# EAGLE design ArduinoPB-Pro-Mini (EAGLE 7.3.0)
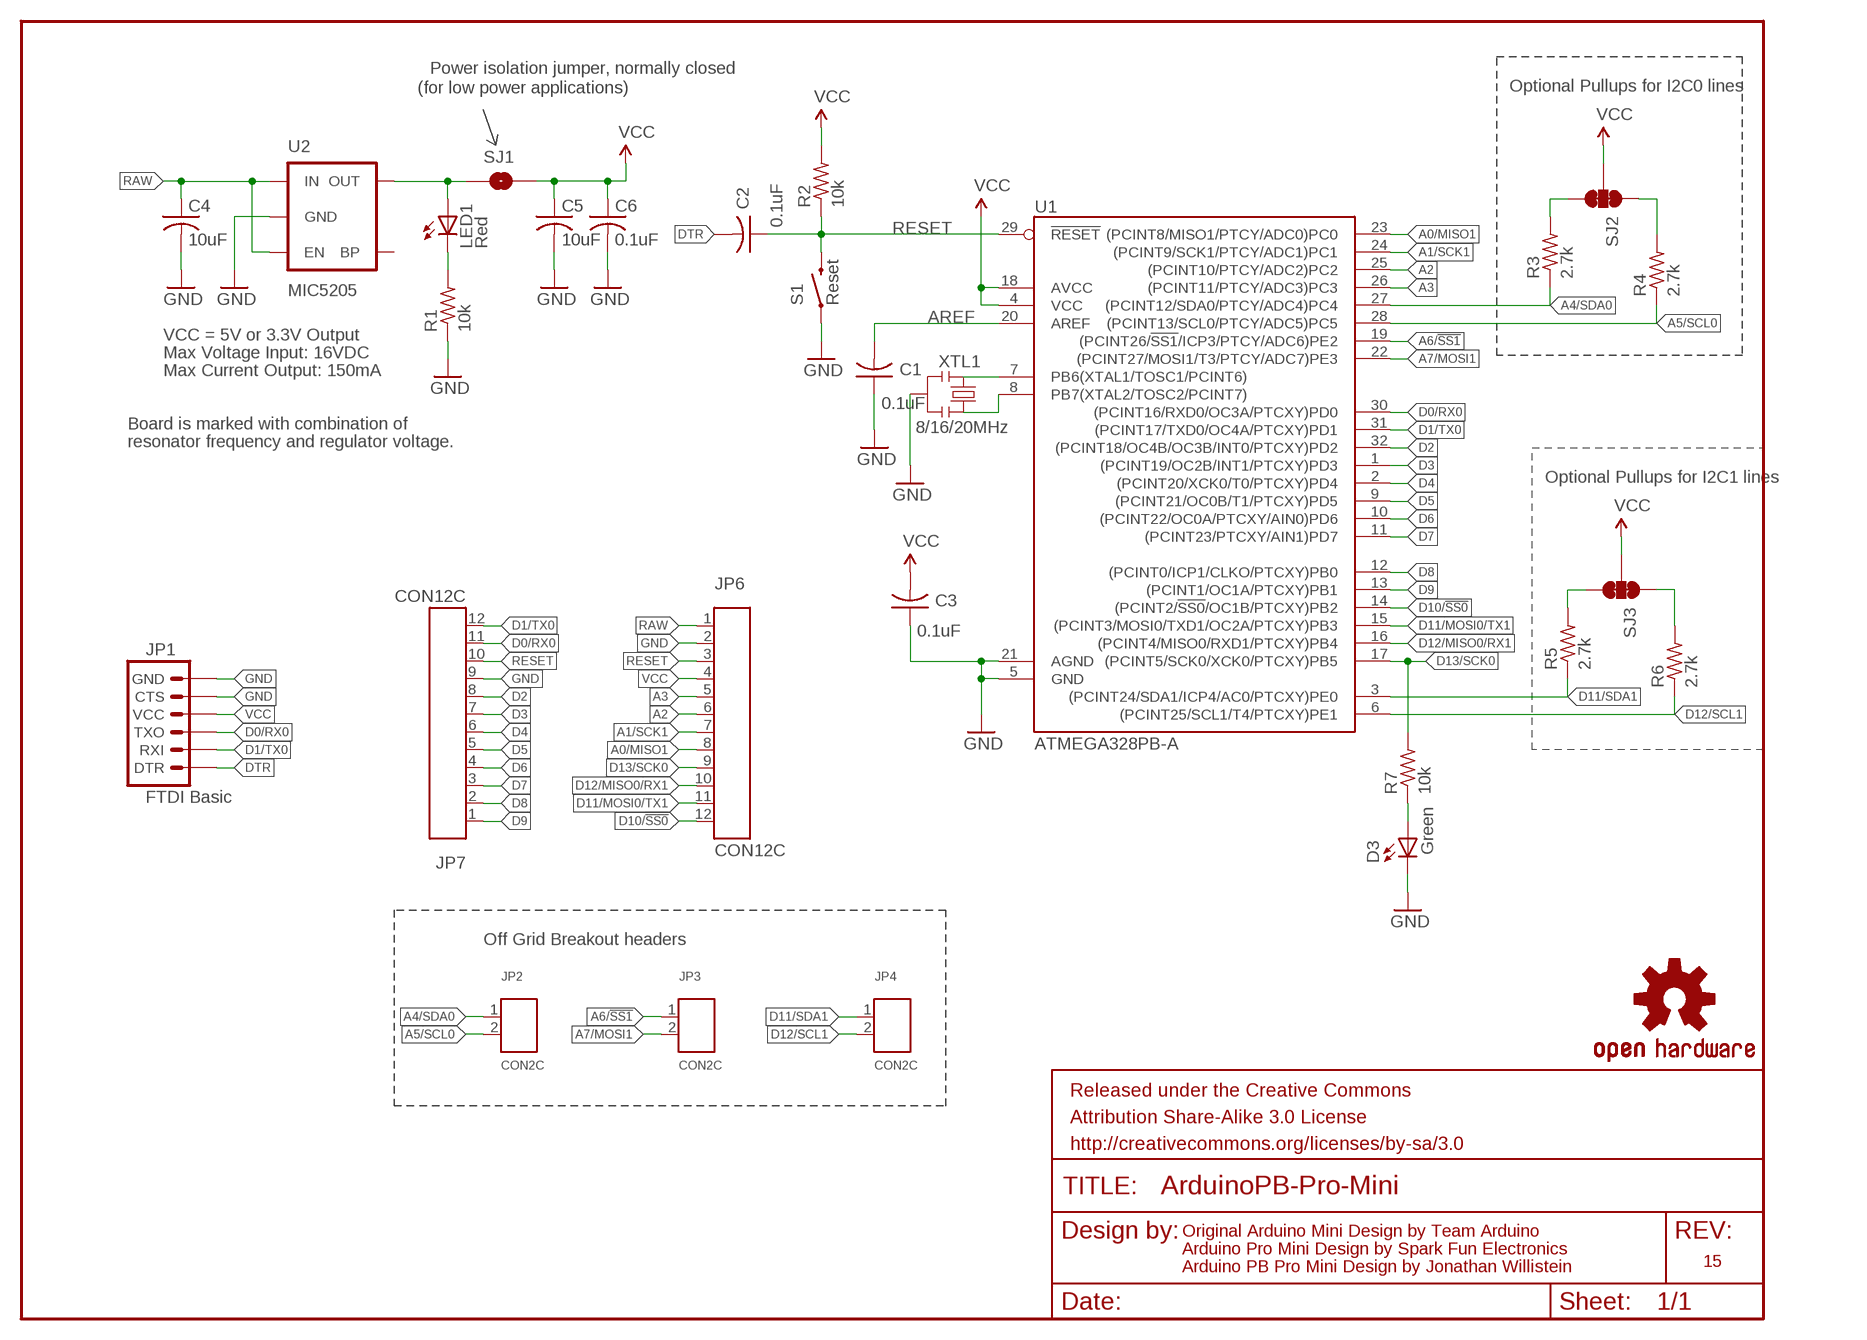
[diagram p0: schematic, sheet 1]

## Parts
C1  0.1uF  C-USC0603  [C0603]
C2  0.1uF  C-USC0603  [C0603]
C3  0.1uF  C-USC0603  [C0603]
C4  10uF  C-USC0805  [C0805]
C5  10uF  C-USC0805  [C0805]
C6  0.1uF  C-USC0603  [C0603]
D3  Green  LED  [0603-LED-ALT1]
FRAME1  FRAME-LETTER  [CREATIVE_COMMONS]
JP1  FTDI Basic  ARDUINO_SERIAL_PROGRAM  [1X6C]
JP2  CON2C  [1X2C]
JP3  CON2C  [1X2C]
JP4  CON2C  [1X2C]
JP6  CON12C  [1X12C]
JP7  CON12C  [1X12C]
LED1  Red  LED  [0603-LED-ALT1]
R1  10k  R-US_R0603  [R0603]
R2  10k  R-US_R0603  [R0603]
R3  2.7k  R-US_R0603  [R0603]
R4  2.7k  R-US_R0603  [R0603]
R5  2.7k  R-US_R0603  [R0603]
R6  2.7k  R-US_R0603  [R0603]
R7  10k  R-US_R0603  [R0603]
S1  Reset  SWITCH-MOMENTARY-2SMD-ALT01  [TACTILE-SWITCH-SMD-ALT01]
SJ1  SOLDERJUMPERTRACE  [SJ_2S-TRACE]
SJ2  JUMPER-PAD-3-NC_BY_TRACE  [PAD-JUMPER-3-3OF3_NC_BY_TRACE_YES_SILK_FULL_BOX]
SJ3  JUMPER-PAD-3-NC_BY_TRACE  [PAD-JUMPER-3-3OF3_NC_BY_TRACE_YES_SILK_FULL_BOX]
U1  ATMEGA328PB-A  [TQFP32-08]
U2  MIC5205  V_REG_LDOSMD  [SOT23-5]
U$3  OSHW-LOGOS  [OSHW-LOGO-S]
XTL1  8/16/20MHz  RESONATOR1:1  [RESONATOR-SMD-1:1]

## Nets
A0/MISO1: JP6.8 U1.23((PCINT8/MISO1/PTCY/ADC0)PC0)
A1/SCK1: JP6.7 U1.24((PCINT9/SCK1/PTCY/ADC1)PC1)
A2: JP6.6 U1.25((PCINT10/PTCY/ADC2)PC2)
A3: JP6.5 U1.26((PCINT11/PTCY/ADC3)PC3)
A4/SDA0: JP2.1 R3.1 U1.27((PCINT12/SDA0/PTCY/ADC4)PC4)
A5/SCL0: JP2.2 R4.1 U1.28((PCINT13/SCL0/PTCY/ADC5)PC5)
A6/!SS1: JP3.1 U1.19((PCINT26/!SS1!/ICP3/PTCY/ADC6)PE2)
A7/MOSI1: JP3.2 U1.22((PCINT27/MOSI1/T3/PTCY/ADC7)PE3)
AREF: C1.2 U1.20(AREF)
D0/RX0: JP1.3(TXO) JP7.11 U1.30((PCINT16/RXD0/OC3A/PTCXY)PD0)
D1/TX0: JP1.2(RXI) JP7.12 U1.31((PCINT17/TXD0/OC4A/PTCXY)PD1)
D2: JP7.8 U1.32((PCINT18/OC4B/OC3B/INT0/PTCXY)PD2)
D3: JP7.7 U1.1((PCINT19/OC2B/INT1/PTCXY)PD3)
D4: JP7.6 U1.2((PCINT20/XCK0/T0/PTCXY)PD4)
D5: JP7.5 U1.9((PCINT21/OC0B/T1/PTCXY)PD5)
D6: JP7.4 U1.10((PCINT22/OC0A/PTCXY/AIN0)PD6)
D7: JP7.3 U1.11((PCINT23/PTCXY/AIN1)PD7)
D8: JP7.2 U1.12((PCINT0/ICP1/CLKO/PTCXY)PB0)
D9: JP7.1 U1.13((PCINT1/OC1A/PTCXY)PB1)
D10/!SS0: JP6.12 U1.14((PCINT2/!SS0!/OC1B/PTCXY)PB2)
D11/MOSI0/TX1: JP6.11 U1.15((PCINT3/MOSI0/TXD1/OC2A/PTCXY)PB3)
D11/SDA1: JP4.1 R5.1 U1.3((PCINT24/SDA1/ICP4/AC0/PTCXY)PE0)
D12/MISO0/RX1: JP6.10 U1.16((PCINT4/MISO0/RXD1/PTCXY)PB4)
D12/SCL1: JP4.2 R6.1 U1.6((PCINT25/SCL1/T4/PTCXY)PE1)
D13/SCK0: JP6.9 R7.2 U1.17((PCINT5/SCK0/XCK0/PTCXY)PB5)
DTR: C2.2 JP1.1(DTR)
GND [vcc]: C1.1 C3.1 C4.2 C5.2 C6.2 D3.C JP1.5(CTS) JP1.6(GND) JP6.2 JP7.9 R1.1 S1.1 S1.2 U1.5(GND) U1.21(AGND) U2.2(GND) XTL1.2
N$1: U1.7(PB6(XTAL1/TOSC1/PCINT6)) XTL1.1
N$2: U1.8(PB7(XTAL2/TOSC2/PCINT7)) XTL1.3
N$4: LED1.C R1.2
N$5: R3.2 SJ2.3
N$6: R4.2 SJ2.1
N$7: D3.A R7.1
N$10: R5.2 SJ3.3
N$11: R6.2 SJ3.1
RAW [vcc]: C4.1 JP6.1 U2.1(IN) U2.3(EN)
RESET: C2.1 JP6.3 JP7.10 R2.1 S1.3 S1.4 U1.29(!RESET!)
VCC: C3.2 C5.1 C6.1 JP1.4(VCC) JP6.4 R2.2 SJ1.2 SJ2.2 SJ3.2 U1.4(VCC) U1.18(AVCC)
VOUT: LED1.A SJ1.1 U2.5(OUT)
Unconnected: U2.4(BP)

## Notes on the sheet
- Power isolation jumper, normally closed
- (for low power applications) | Optional Pullups for I2C0 lines
- VCC = 5V or 3.3V Output
- Max Voltage Input: 16VDC
- Max Current Output: 150mA
- Board is marked with combination of
- resonator frequency and regulator voltage.
- Optional Pullups for I2C1 lines
- Off Grid Breakout headers
- Original Arduino Mini Design by Team Arduino
- Arduino Pro Mini Design by Spark Fun Electronics
- 15
- Arduino PB Pro Mini Design by Jonathan Willistein

## Library data of the parts
C1-C6 = rcl:C-US: CAPACITOR, American symbol
D3 LED1 = Testing:LED: LEDs Standard schematic elements and footprints for 5mm, 3mm, 1206, and 0603 sized LEDs. 5mm - Spark Fun Electronics SKU : COM-00529 (and others)
FRAME1 = SparkFun-Aesthetics:FRAME-LETTER: Schematic Frame Standard 8.5x11 US Letter frame
JP1 = Conn - Custom:ARDUINO_SERIAL_PROGRAM
JP2-JP4 = Conn - Rect - Headers,Male Pins - Jumpers:CON2
JP6 JP7 = Conn - Rect - Headers,Male Pins - Jumpers:CON12: 8-pin Thru-hole Header
R1-R7 = rcl:R-US_: RESISTOR, American symbol
S1 = Testing:SWITCH-MOMENTARY-2: Various NO switches- pushbuttons, reed, etc
SJ1 = Conn - Custom:SOLDERJUMPER: Solder Jumper Standard SMD solder jumper. Used to automate production. Two varients : Normally Open and Normally Closed are the same, but have different paste layers. NC will have a large amount of paste and should jumper during reflow.
SJ2 SJ3 = Conn - Custom:JUMPER-PAD-3-NC_BY_TRACE
U1 = IC - uC - AVR:ATMEGA328PB-?: MICROCONTROLLER 32 kBytes FLASH 2 kBytes SRAM 1 kBytes EEPROM 1.8V to 5.5V Peripheral Touch Controller 2 8-bit Timer/Counters, TC2 can be RTC 3 16-bit Timer/Counters 10 PWM channels Output Compare Modulator 8-channel 10 bit ADC 2 USART 2 SPI 2 I2C Watch Dog timer Analog Comparator Interrupt and Wake-up on Pin change
U2 = SparkFun:V_REG_LDO: Voltage Regulator LDO Standard 150mA LDO voltage regulator in SOT-23 layout. Micrel part MIC5205. BP (by-pass) pin is used to lower output noise with 470pF cap.
U$3 = SparkFun:OSHW-LOGO: Open Source Hardware Logo This logo indicates the piece of hardware it is found on incorporates a OSHW license and/or adheres to the definition of open source hardware found here: http://freedomdefined.org/OSHW
XTL1 = Testing:RESONATOR: Resonator Small SMD resonator. This is the itty bitty 10/20MHz resonators with built in caps. CSTCE10M0G55 and CSTCE20M0V53. Footprint for SMD has been used in SFE production for years, and does work okay. 1:1 is an attempt to get larger fillets on the sides so it will be easier to inspect these solders in our AOI machine. The pads have been minimized to match the actual metal under the resonator. To see this relation, it includes an image import of the bottom side of the component. Imported to scale on layer 200.

## Net classes
0 default: width 0.203 mm
1 vcc: width 0.254 mm

## Board
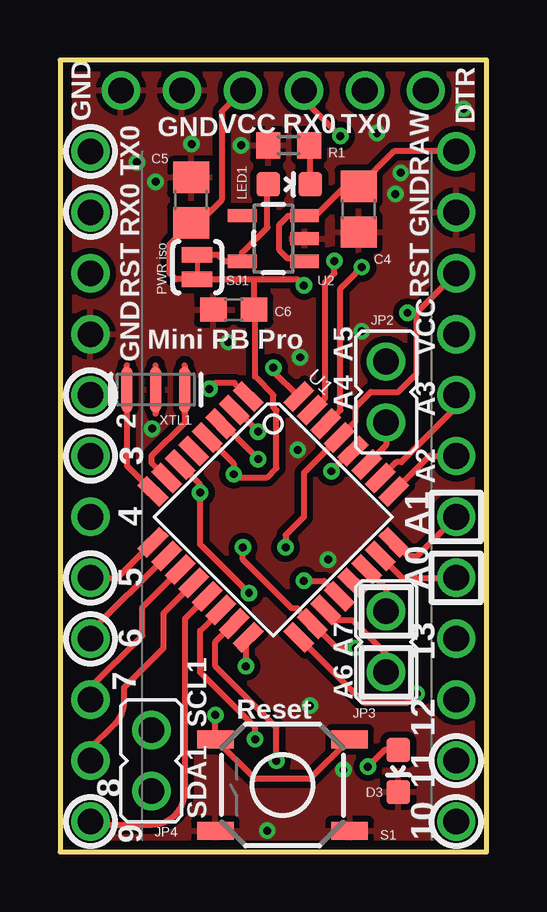
[diagram p1: board, top side]
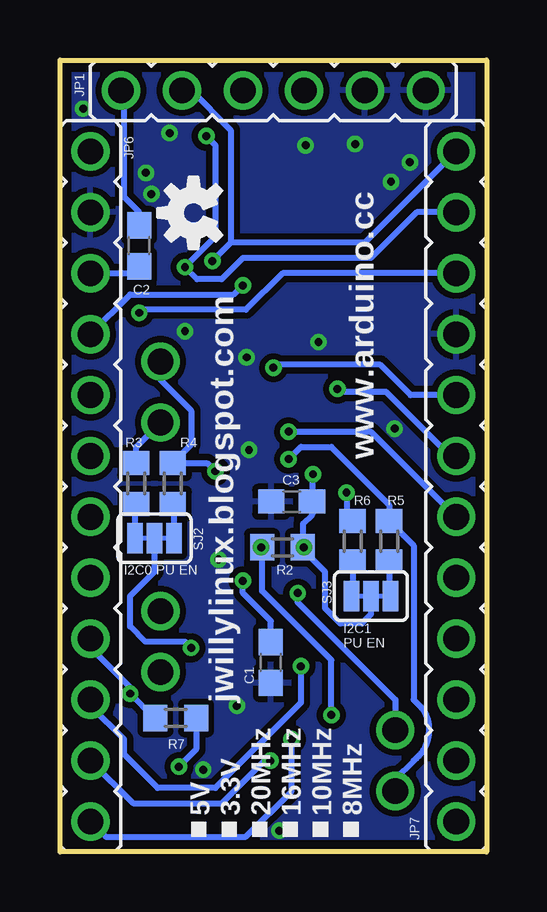
[diagram p2: board, bottom side, seen from below]

Size 17.78 x 33.02 mm. Coordinates in mm from the lower left corner, seen from the top.
Outline: 0,33.02 0,0 17.78,0 17.78,33.02 0,33.02
Copper layers (1*16): Top 0.0356mm / dielectric 1.5011mm / Bottom 0.0356mm
Design rules "LaenPCBOrder *": minimum track width 6mil, minimum drill 13mil, track to track 6mil, track to pad 6mil, pad to pad 6mil, via to via 6mil, smd to smd 6mil, copper to edge 15mil, drill to drill 6mil, minimum pad ring 7mil, minimum via ring 7mil, stop-mask expansion 3mil, vias tented up to drill 13mil, thermal gap 10mil

### Footprints (pad centres in the part's own frame; a part is rotated, then mirrored left to right if it is on the bottom)
C0603 = smd 1.1 x 1: 1 -0.85,0; 2 0.85,0
C0805 = smd 1.3 x 1.5: 1 -0.95,0; 2 0.95,0
0603-LED-ALT1 = smd 1 x 1: A 0,-0.877; C 0,0.877
1X6C = drill 1.067: 1 0,0; 2 2.54,0; 3 5.08,0; 4 7.62,0; 5 10.16,0; 6 12.7,0
1X2C = drill 1.067: 1 0,0; 2 2.54,0
1X12C = drill 1.067: 1 0,0; 2 2.54,0; 3 5.08,0; 4 7.62,0; 5 10.16,0; 6 12.7,0; 7 15.24,0; 8 17.78,0; 9 20.32,0; 10 22.86,0; 11 25.4,0; 12 27.94,0
R0603 = smd 1 x 1.1: 1 -0.85,0; 2 0.85,0
TACTILE-SWITCH-SMD-ALT01 = smd 1.524 x 0.762: 1 -2.794,1.905; 2 2.794,1.905; 3 -2.794,-1.905; 4 2.794,-1.905
SJ_2S-TRACE = smd 0.635 x 1.27: 1 -0.508,0; 2 0.508,0
PAD-JUMPER-3-3OF3_NC_BY_TRACE_YES_SILK_FULL_BOX = smd 0.635 x 1.27: 1 -0.813,0; 2 0,0; 3 0.813,0
TQFP32-08 = smd 1.27 x 0.559: 1 -4.293,2.8; 2 -4.293,2; 3 -4.293,1.2; 4 -4.293,0.4; 5 -4.293,-0.4; 6 -4.293,-1.2; 7 -4.293,-2; 8 -4.293,-2.8; 17 4.293,-2.8; 18 4.293,-2; 19 4.293,-1.2; 20 4.293,-0.4; 21 4.293,0.4; 22 4.293,1.2; 23 4.293,2; 24 4.293,2.8 | smd 0.559 x 1.27: 9 -2.8,-4.293; 10 -2,-4.293; 11 -1.2,-4.293; 12 -0.4,-4.293; 13 0.4,-4.293; 14 1.2,-4.293; 15 2,-4.293; 16 2.8,-4.293; 25 2.8,4.293; 26 2,4.293; 27 1.2,4.293; 28 0.4,4.293; 29 -0.4,4.293; 30 -1.2,4.293; 31 -2,4.293; 32 -2.8,4.293
SOT23-5 = smd 0.55 x 1.2: 1 -0.95,-1.3; 2 0,-1.3; 3 0.95,-1.3; 4 0.95,1.3; 5 -0.95,1.3
RESONATOR-SMD-1:1 = smd 0.45 x 1.905: 1 -1.2,0; 2 0,0; 3 1.2,0

### Placement (x,y rotation side)
C1  8.99,7.9 90 bottom
C2  14.48,25.27 90 bottom
C3  8.13,14.61 0 bottom
C4  12.45,26.8 270 top
C5  5.46,27.18 90 top
C6  7.24,22.61 180 top
D3  14.1,3.38 180 top
FRAME1  -15.98,-8.89 0 top  (outside the outline)
JP1  15.24,31.75 0 bottom
JP2  13.59,17.91 90 top
JP3  13.59,7.49 90 top
JP4  3.81,2.54 90 top
JP6  16.51,29.21 270 bottom
JP7  1.27,1.27 90 bottom
LED1  9.55,27.84 270 top
R1  9.53,29.46 0 top
R2  8.51,12.7 0 bottom
R3  14.61,15.37 270 bottom
R4  13.08,15.37 270 bottom
R5  4.06,12.95 270 bottom
R6  5.59,12.95 270 bottom
R7  12.95,5.59 180 bottom
S1  9.27,2.79 180 top
SJ1  5.71,24.38 270 top
SJ2  13.84,13.08 180 bottom
SJ3  4.83,10.67 0 bottom
U1  8.89,13.97 315 top
U2  8.89,25.58 90 top
U$3  12.22,26.64 90 bottom
XTL1  3.99,19.28 180 top

### Tracks (layer width: path | path; a pad name or v marks a point on that pad's centre or on a via)
A0/MISO1
  Top 0.254: U1.23 14.26,11.43 JP6.8
A1/SCK1
  Top 0.254: JP6.7 14.86,12.32 14.5,12.32 U1.24
A2
  Top 0.254: U1.25 15.39,16.51 JP6.6
A3
  Top 0.254: U1.26 14,16.26 14.22,16.26 16.51,18.54 JP6.5
A4/SDA0
  Top 0.254: JP2.1 13.59,16.97 U1.27
  Bottom 0.254: R3.1 14.61,16.89 JP2.1
A5/SCL0  (via drill 0.33)
  Top 0.254: U1.28 12.15,16.72 v11.3,15.88
  Bottom 0.254: v11.3,15.88 11.64,16.22 R4.1 12.32,16.98 12.32,18.41 13.59,19.68 JP2.2
A6/!SS1
  Top 0.254: JP3.1 13.59,8.26 12.19,9.65 11.51,9.65 U1.19
A7/MOSI1
  Top 0.254: U1.22 13.59,10.97 JP3.2
AREF  (via drill 0.33)
  Top 0.254: v10.16,11.3 10.99,11.3 U1.20
  Bottom 0.254: C1.2 8.99,9.63 10.16,10.79 v10.16,11.3
D0/RX0  (via drill 0.33)
  Top 0.254: U1.30 11.12,17.85 11.68,18.41 11.68,23.5 v12.57,24.38 | v11.68,29.84 10.16,31.37 JP1.3
  Bottom 0.254: JP7.11 2.92,26.67 4.83,24.77 10.16,24.77 11.05,23.88 12.06,23.88 v12.57,24.38 11.3,25.65 11.3,29.46 v11.68,29.84
D1/TX0  (via drill 0.33)
  Top 0.254: U1.31 10.55,18.42 11.05,18.92 11.05,23.75 11.43,24.13 v11.43,24.64
  Bottom 0.254: 10.67,25.4 10.67,30.1 12.32,31.75 JP1.2 | JP7.12 5.08,25.4 10.67,25.4 | 10.67,25.4 v11.43,24.64
D2  (via drill 0.33)
  Top 0.254: 9.95,19.01 U1.32 8.89,20.04 v8.89,20.19
  Bottom 0.254: JP7.8 3.17,19.05 4.45,20.32 8.76,20.32 v8.89,20.19
D3  (via drill 0.33)
  Top 0.254: U1.1 7.26,19.56 6.48,19.56 v6.22,19.3
  Bottom 0.254: JP7.7 1.52,16.51 4.19,19.18 6.1,19.18 v6.22,19.3
D4  (via drill 0.33)
  Top 0.254: U1.2 7.36,18.42 v8.26,17.53
  Bottom 0.254: v8.26,17.53 4.83,17.53 JP7.6
D5
  Top 0.254: JP7.5 2.39,11.43 U1.9
D6
  Top 0.254: JP7.4 1.27,9.18 U1.10
D7
  Top 0.254: JP7.3 1.27,6.86 3.43,9.02 3.43,10.21 U1.11
D8
  Top 0.254: JP7.2 1.27,4.32 2.29,5.34 arc45 2.67,6.24 2.67,6.86 4.32,8.51 4.32,9.96 U1.12
D9
  Top 0.254: U1.13 5.21,9.72 5.21,2.54 arc-90 3.81,1.14 1.4,1.14 JP7.1
D10/!SS0  (via drill 0.33)
  Top 0.254: v8.13,4.7 8.13,5.21 5.84,7.49 5.84,9.22 U1.14
  Bottom 0.254: JP6.12 15.88,0.64 10.03,0.64 8.13,2.54 v8.13,4.7
D11/MOSI0/TX1  (via drill 0.33)
  Top 0.254: v9.02,3.81 9.02,5.21 6.48,7.75 6.48,8.76 7.23,9.52 U1.15
  Bottom 0.254: JP6.11 14.73,2.03 11.05,2.03 9.27,3.81 v9.02,3.81
D11/SDA1  (via drill 0.33)
  Top 0.254: U1.3 6.78,17.85 v8.26,16.38
  Bottom 0.254: v8.26,16.38 7.75,16.89 6.48,16.89 4.06,14.48 R5.1 3.05,12.79 3.05,6.35 2.79,6.09 arc45 2.41,5.19 2.41,5.08 arc53 3.05,3.81 3.81,3.05 JP4.1
D12/MISO0/RX1  (via drill 0.33)
  Top 0.254: U1.16 7.75,8.87 v7.75,7.75
  Bottom 0.254: v7.75,7.75 7.75,6.22 11.3,2.67 13.72,2.67 15.11,4.06 15.11,4.7 16.51,6.1 JP6.10
D12/SCL1  (via drill 0.33)
  Top 0.254: U1.6 5.84,15.32 v5.84,14.99 5.84,12.83 v7.87,10.79
  Bottom 0.254: v5.84,14.99 5.84,14.06 R6.1 | v7.87,10.79 7.87,10.41 3.81,6.35 JP4.2
D13/SCK0  (via drill 0.33)
  Top 0.254: U1.17 12.68,6.22 14.48,6.22 v14.86,6.6
  Bottom 0.254: JP6.9 16.26,8.64 16.26,8.26 14.86,6.86 v14.86,6.6 13.84,5.59 R7.2
DTR
  Bottom 0.254: C2.2 14.48,26.67 15.11,27.3 15.11,31.62 JP1.1
GND  (via drill 0.33)
  other vias: 11.18,12.19 12.57,21.72 10.41,6.1 3.84,17.65 10.01,20.62 13.97,27.43 14.2,28.32 7.54,29.46 5.49,29.51 11.81,3.43 3.2,28.75 7.01,21.26 9.91,16.76 13.21,29.97 8.64,0.89 16.81,30.99 3.99,27.94
  pour Top (isolate 0.254): 0,33.02 17.78,33.02 17.78,0 0,0
  pour Bottom (isolate 0.254): 0,33.02 17.78,33.02 17.78,0 0,0
N$1
  Top 0.254: 5.19,18.26 5.19,17.89 3.81,16.51 3.81,16.22 U1.7
N$2
  Top 0.254: 2.79,18.26 2.79,16.11 U1.8
N$4
  Top 0.254: LED1.C 10.43,29.41 R1.2
N$5
  Bottom 0.254: R3.2 14.66,14.47 SJ2.3
N$6
  Bottom 0.254: R4.2 13.03,14.47 SJ2.1
N$7  (via drill 0.33)
  Top 0.254: D3.A 13.53,4.25 v12.83,3.56
  Bottom 0.254: R7.1 12.1,4.28 v12.83,3.56
N$10
  Bottom 0.254: R5.2 4.06,10.72 SJ3.3
N$11
  Bottom 0.254: R6.2 5.59,10.72 SJ3.1
RAW
  Top 0.254: U2.1 10.08,24.74 9.5,24.74 9.14,25.09 9.14,26.16 9.51,26.53 U2.3 10.65,26.53 11.81,27.69 12.38,27.69 C4.1 13.91,29.21 JP6.1
RESET  (via drill 0.33)
  Top 0.254: v6.48,5.71 S1.4 8.13,3.05 10.41,3.05 S1.3 | v9.4,12.7 9.4,13.21 10.16,13.97 10.16,15.81 U1.29 12.32,17.96 12.32,18.54 12.95,19.18 14.1,19.18 14.86,19.94 14.86,22.48 | 14.86,22.48 JP6.3 | 14.86,22.48 v14.48,22.48
  Bottom 0.254: v6.48,5.71 6.48,8 9.36,10.88 R2.1 | 9.4,12.66 R2.1 | R2.1 v9.4,12.7 | JP7.10 8.51,24.13 10.03,22.61 14.35,22.61 v14.48,22.48 | JP6.3 14.77,24.13 C2.1
VCC  (via drill 0.33)
  Top 0.254: U1.4 7.24,16.19 v7.24,15.75 7.37,15.62 8.64,15.62 9.02,16 9.02,18.41 8.89,18.54 8.89,19.05 8.13,19.81 8.13,22.57 C6.1 8.09,23.84 8.13,23.88 | v7.62,12.7 7.62,12.19 9.65,10.16 9.87,10.16 U1.18 11.52,8.51 v12.32,8.51 | 8.13,23.88 SJ1.2 4.83,23.88 4.57,24.13 4.57,25.34 C5.1 5.78,26.23 6.73,27.18 6.73,30.86 JP1.4 | 8.13,23.88 9.91,23.88 v10.16,23.62
  Bottom 0.254: 7.66,12.41 R2.2 | v7.24,15.75 7.24,14.77 C3.2 7.28,14.06 7.66,13.68 R2.2 | SJ3.2 4.83,9.91 5.21,9.53 6.1,9.53 6.73,10.16 6.73,11.68 7.62,12.57 v7.62,12.7 R2.2 | JP6.4 14.86,23.24 10.54,23.24 v10.16,23.62 | SJ2.2 13.84,11.68 14.86,10.67 14.86,9.4 14.22,8.76 12.57,8.76 v12.32,8.51
VOUT
  Top 0.254: SJ1.1 6.6,24.89 6.87,24.63 U2.5 7.59,24.99 8.64,26.04 8.64,27.8 LED1.A

### Text on the board
tPlace: GND | GND | VCC | RX0 | TX0 | DTR | TX0 | RAW | RX0 | GND | RST | PWR iso | RST | Mini PB Pro | VCC | GND | A5 | 2 | A4 | A3 | 3 | A2 | 4 | A1 | 5 | A0 | 6 | A7 | 13 | 7 | Reset | A6 | SCL1 | 12 | 11 | 8 | SDA1 | 10 | 9
bPlace: www.arduino.cc | I2C0 PU EN | I2C1 / PU EN | jwillylinux.blogspot.com | 8MHz | 10MHz | 16MHz | 20MHz | 3.3V | 5V
tDocu: Original Arduino Mini Design by Team Arduino / Arduino Pro Mini Design by SparkFun Electronics / Revised by Pete Lewis / Changed to PB version by Jon Willistein